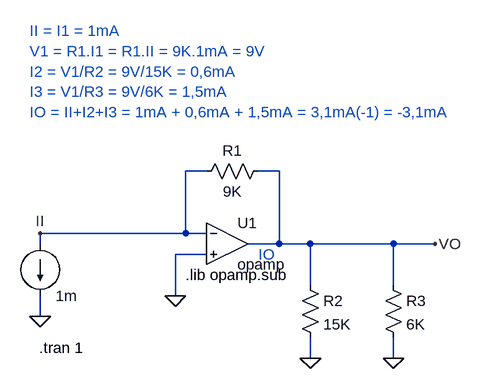
[diagram p0: schematic AMP08 - Amplificadores Ideais - Exercicio I.asc]
AMP08 - Amplificadores Ideais - Exercicio I.asc, the LTspice schematic file:
Version 4
SHEET 1 880 704
WIRE 144 16 112 16
WIRE 256 16 224 16
WIRE 112 112 112 16
WIRE 112 112 -112 112
WIRE 144 112 112 112
WIRE -112 128 -112 112
WIRE 256 128 256 16
WIRE 256 128 208 128
WIRE 304 128 256 128
WIRE 432 128 304 128
WIRE 496 128 432 128
WIRE 144 144 96 144
WIRE 304 192 304 128
WIRE 432 192 432 128
WIRE 96 208 96 144
WIRE -112 240 -112 208
WIRE 304 304 304 272
WIRE 432 304 432 272
FLAG 496 128 VO
FLAG 304 304 0
FLAG 432 304 0
FLAG 96 208 0
FLAG -112 240 0
FLAG -112 112 II
SYMBOL Opamps\\opamp 176 64 R0
SYMATTR InstName U1
SYMBOL res 240 0 R90
WINDOW 0 0 56 VBottom 2
WINDOW 3 32 56 VTop 2
SYMATTR InstName R1
SYMATTR Value 9K
SYMBOL res 288 176 R0
SYMATTR InstName R2
SYMATTR Value 15K
SYMBOL res 416 176 R0
SYMATTR InstName R3
SYMATTR Value 6K
SYMBOL current -112 128 R0
WINDOW 0 24 0 Invisible 2
WINDOW 123 0 0 Left 2
WINDOW 39 0 0 Left 2
SYMATTR InstName I1
SYMATTR Value 1m
TEXT 112 176 Left 2 !.lib opamp.sub
TEXT -114 288 Left 2 !.tran 1
TEXT -128 -200 Left 2 ;II = I1 = 1mA\nV1 = R1.I1 = R1.II = 9K.1mA = 9V\nI2 = V1/R2 = 9V/15K = 0,6mA\nI3 = V1/R3 = 9V/6K = 1,5mA\nIO = II+I2+I3 = 1mA + 0,6mA + 1,5mA = 3,1mA(-1) = -3,1mA
TEXT 224 144 Left 2 ;IO

The netlist it stands for:
* AMP08 - Amplificadores Ideais - Exercicio I.asc
XU1 II 0 VO opamp Aol=100K GBW=10Meg  ; pins invin noninvin out
R1 VO II 9K
R2 VO 0 15K
R3 VO 0 6K
I1 II 0 1m
.lib opamp.sub
.tran 1
* II = I1 = 1mA
* V1 = R1.I1 = R1.II = 9K.1mA = 9V
* I2 = V1/R2 = 9V/15K = 0,6mA
* I3 = V1/R3 = 9V/6K = 1,5mA
* IO = II+I2+I3 = 1mA + 0,6mA + 1,5mA = 3,1mA(-1) = -3,1mA
* IO
.backanno
.end